# Altium schematic sheet IR_SCOOTER.SchDoc: IR_SCOOTER
size 420 x 297 mm; Engineer: ALPER KORKMAZ; SheetNumber: 1; SheetTotal: 8; SHEET: 1
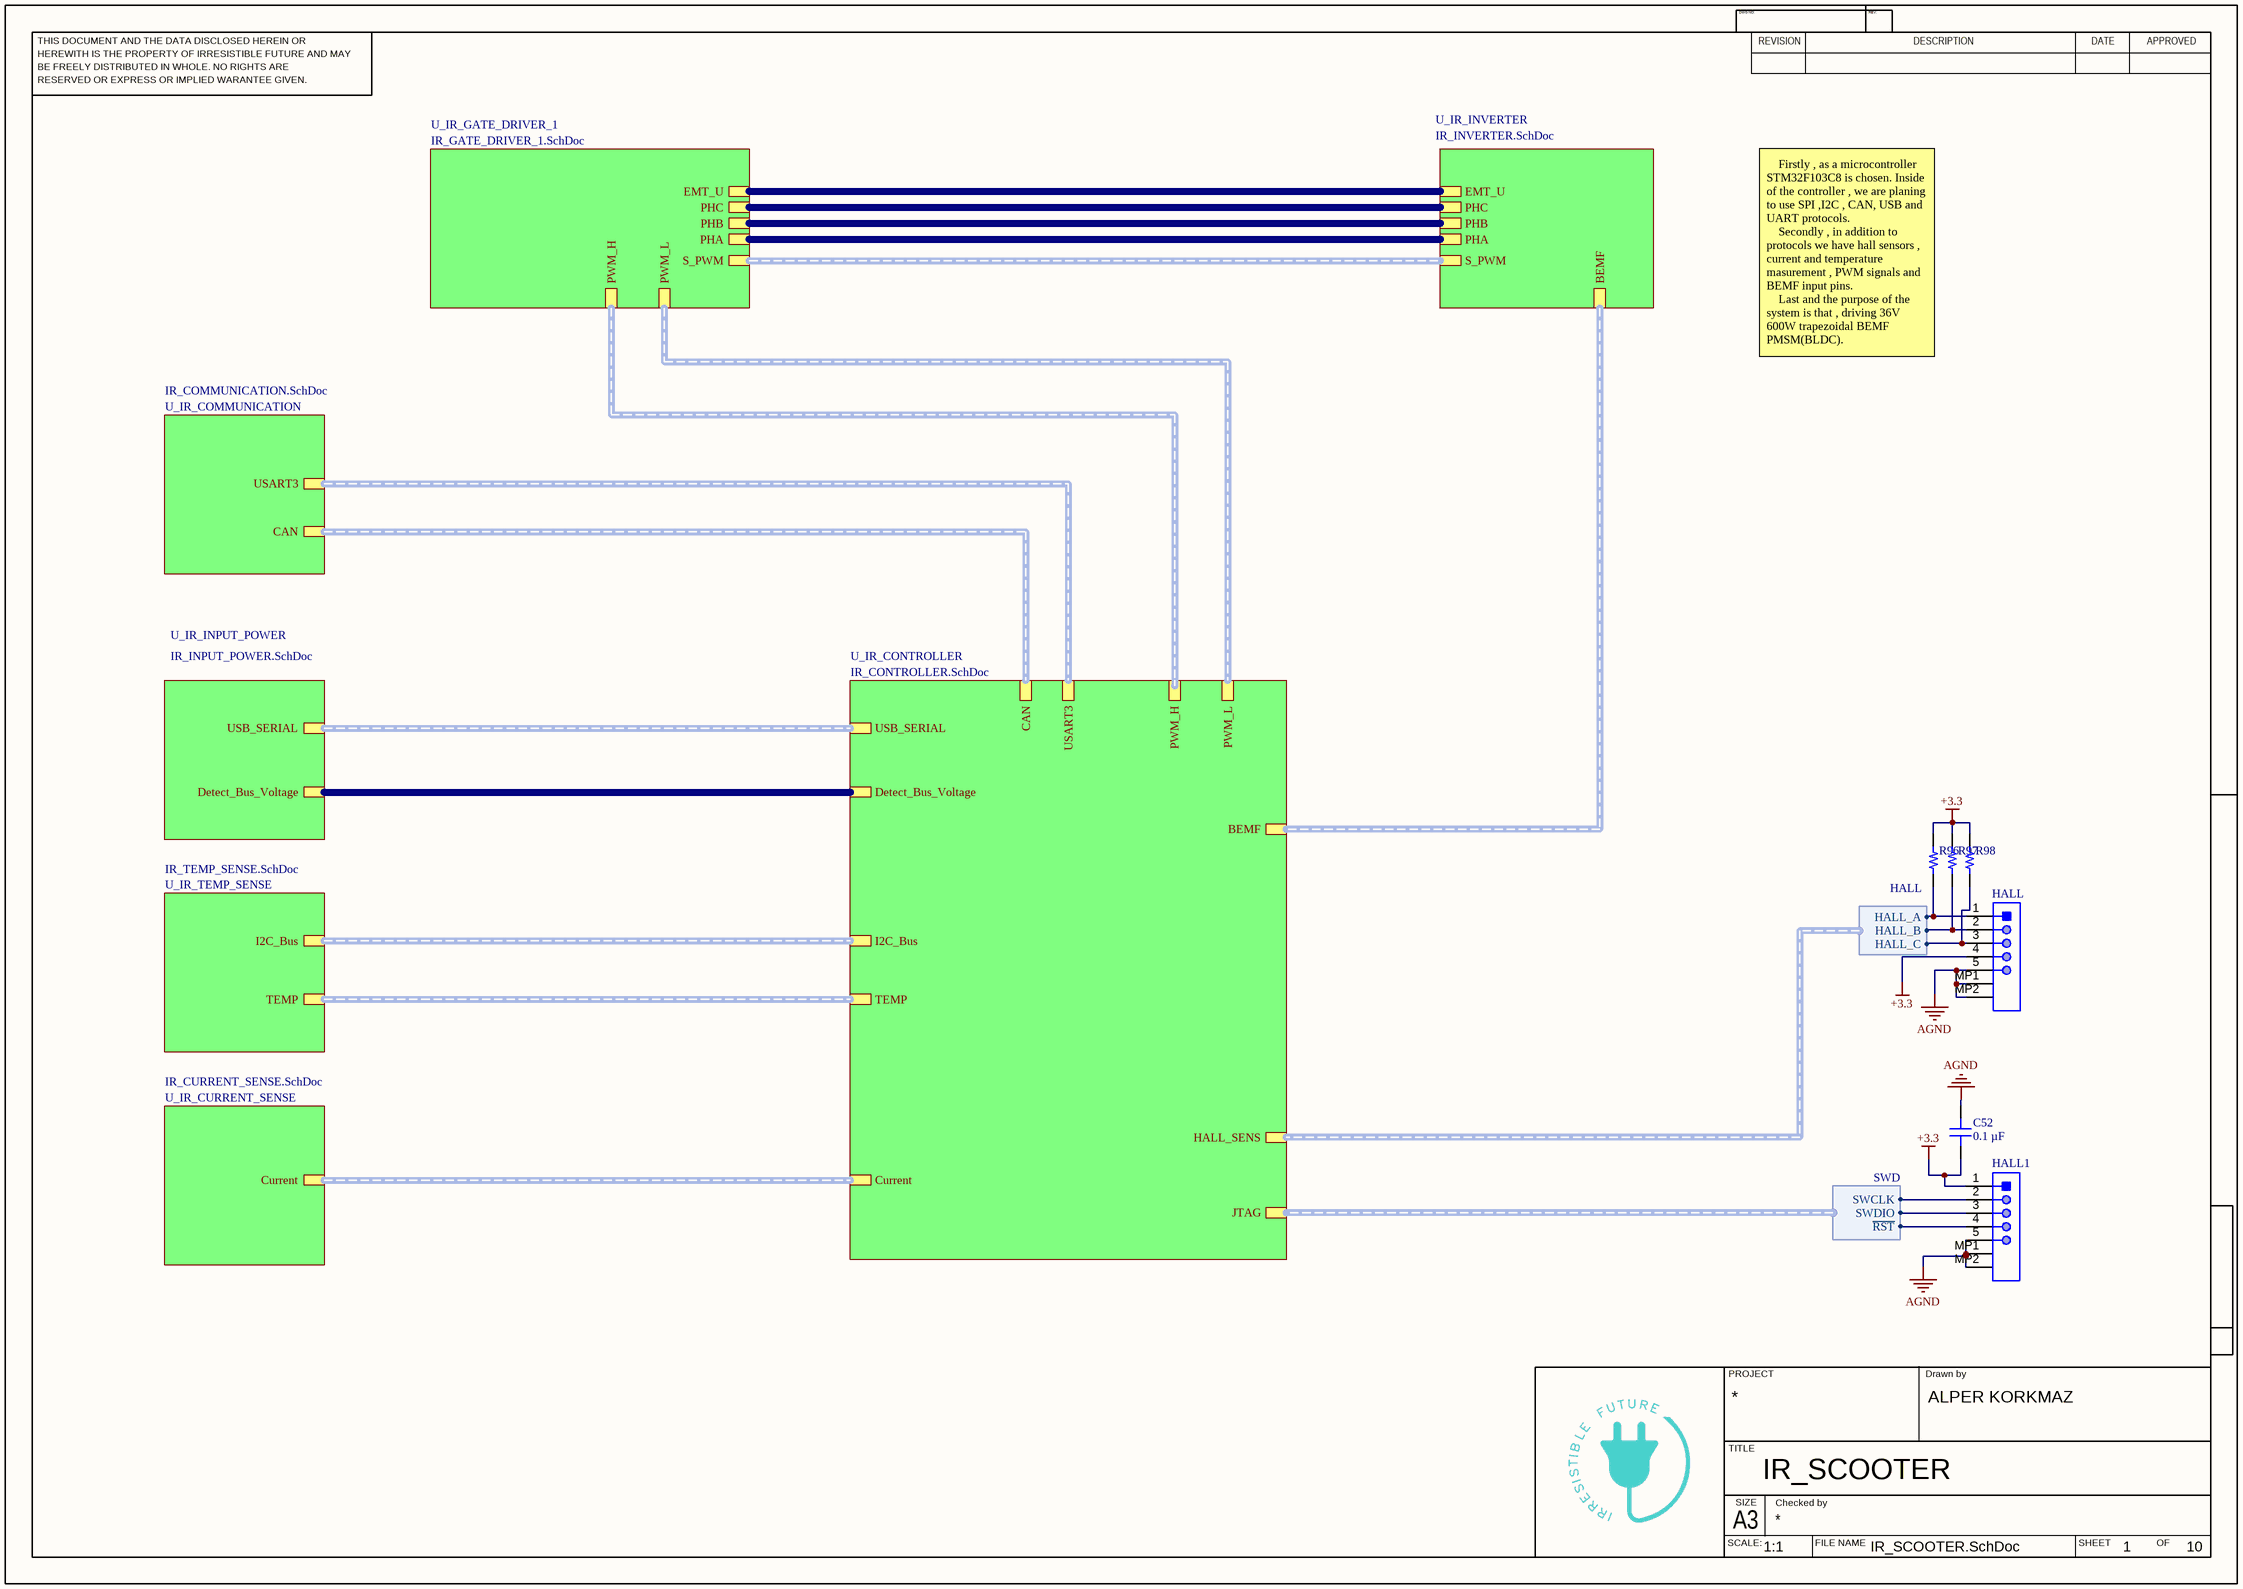
[diagram p0: IR_SCOOTER.SchDoc]

## Parts
C52  0.1 µF  [CAP 0805_2012]
HALL  53261-0571  [MOLX-52361-0571-5_V]  (value not drawn)
HALL1  53261-0571  [MOLX-52361-0571-5_V]  (value not drawn)
R96  10 kOhms  [RES 0603_1608]  (value not drawn)
R97  10 kOhms  [RES 0603_1608]  (value not drawn)
R98  10 kOhms  [RES 0603_1608]  (value not drawn)

## Sub-sheets
U_IR_COMMUNICATION = IR_COMMUNICATION.SchDoc: USART3 (harness SERIAL), CAN (harness CAN)
U_IR_CONTROLLER = IR_CONTROLLER.SchDoc: HALL_SENS (harness HALL), PWM_H (harness PWM_H), JTAG (harness SWD), BEMF (harness BEMF), USB_SERIAL (harness USB), PWM_L (harness PWM_L), I2C_Bus (harness I2C), Current (harness Current), CAN (harness CAN), USART3 (harness SERIAL), TEMP (harness TEMP), Detect_Bus_Voltage
U_IR_CURRENT_SENSE = IR_CURRENT_SENSE.SchDoc: Current (harness Current)
U_IR_GATE_DRIVER_1 = IR_GATE_DRIVER_1.SchDoc: S_PWM (harness S_PWM), PHA, PHB, PHC, EMT_U, PWM_H (harness PWM_H), PWM_L (harness PWM_L)
U_IR_INPUT_POWER = IR_INPUT_POWER.SchDoc: Detect_Bus_Voltage, USB_SERIAL (harness USB)
U_IR_INVERTER = IR_INVERTER.SchDoc: BEMF (harness BEMF), S_PWM (harness S_PWM), PHA, PHB, PHC, EMT_U
U_IR_TEMP_SENSE = IR_TEMP_SENSE.SchDoc: I2C_Bus (harness I2C), TEMP (harness TEMP)

## Harnesses
SWD: SWCLK, SWDIO, ~{RST}
HALL: HALL_C, HALL_B, HALL_A

## Nets
+3.3: C52.1 HALL.4 HALL1.1 R96.2 R97.2 R98.2
AGND: C52.2 HALL.5 HALL.MP1 HALL.MP2 HALL1.5 HALL1.MP1 HALL1.MP2
NetHALL1_2: HALL1.2 ; sheet U_IR_CONTROLLER/JTAG.SWCLK
NetHALL1_3: HALL1.3 ; sheet U_IR_CONTROLLER/JTAG.SWDIO
NetHALL1_4: HALL1.4 ; sheet U_IR_CONTROLLER/JTAG.~{RST}
NetHALL_1: HALL.1 R96.1 ; sheet U_IR_CONTROLLER/HALL_SENS.HALL_A
NetHALL_2: HALL.2 R97.1 ; sheet U_IR_CONTROLLER/HALL_SENS.HALL_B
NetHALL_3: HALL.3 R98.1 ; sheet U_IR_CONTROLLER/HALL_SENS.HALL_C
(unnamed): sheet U_IR_CONTROLLER/Detect_Bus_Voltage, sheet U_IR_INPUT_POWER/Detect_Bus_Voltage
(unnamed): sheet U_IR_GATE_DRIVER_1/PHA, sheet U_IR_INVERTER/PHA
(unnamed): sheet U_IR_GATE_DRIVER_1/PHB, sheet U_IR_INVERTER/PHB
(unnamed): sheet U_IR_GATE_DRIVER_1/PHC, sheet U_IR_INVERTER/PHC
(unnamed): sheet U_IR_GATE_DRIVER_1/EMT_U, sheet U_IR_INVERTER/EMT_U

## Buses and harness runs
harness sheet U_IR_COMMUNICATION/CAN = sheet U_IR_CONTROLLER/CAN
harness sheet U_IR_COMMUNICATION/USART3 = sheet U_IR_CONTROLLER/USART3
harness sheet U_IR_CONTROLLER/BEMF = sheet U_IR_INVERTER/BEMF
harness sheet U_IR_CONTROLLER/Current = sheet U_IR_CURRENT_SENSE/Current
harness sheet U_IR_CONTROLLER/I2C_Bus = sheet U_IR_TEMP_SENSE/I2C_Bus
harness sheet U_IR_CONTROLLER/PWM_H = sheet U_IR_GATE_DRIVER_1/PWM_H
harness sheet U_IR_CONTROLLER/PWM_L = sheet U_IR_GATE_DRIVER_1/PWM_L
harness sheet U_IR_CONTROLLER/TEMP = sheet U_IR_TEMP_SENSE/TEMP
harness sheet U_IR_CONTROLLER/USB_SERIAL = sheet U_IR_INPUT_POWER/USB_SERIAL
harness sheet U_IR_GATE_DRIVER_1/S_PWM = sheet U_IR_INVERTER/S_PWM

## Notes on the sheet
- Firstly , as a microcontroller STM32F103C8 is chosen. Inside of the controller , we are planing to use SPI ,I2C , CAN, USB and UART protocols.
  Secondly , in addition to protocols we have hall sensors , current and temperature masurement , PWM signals and BEMF input pins.
  Last and the purpose of the system is that , driving 36V 600W trapezoidal BEMF PMSM(BLDC).
- THIS DOCUMENT AND THE DATA DISCLOSED HEREIN OR
- HEREWITH IS THE PROPERTY OF IRRESISTIBLE FUTURE AND MAY
- DWG NO:
- REVISION
- REV:
- DESCRIPTION
- DATE
- APPROVED
- BE FREELY DISTRIBUTED IN WHOLE. NO RIGHTS ARE
- RESERVED OR EXPRESS OR IMPLIED WARANTEE GIVEN.
- PROJECT
- Drawn by
- TITLE
- SCALE:
- A3
- SIZE
- Checked by
- FILE NAME
- SHEET
- OF
- 1:1
- 10

## Library data of the parts
C52 = HMK212BJ104KG-T: CAP CER 0.1UF 100V X5R 0805; manufacturer: Taiyo Yuden; Tolerance: ±10%; Part Number: HMK212BJ104KG-T; Value: 0.1 µF; Applications: SMPS Filtering; Capacitance: 0.1 µF; componentlink1description: Datasheet; componentlink1url: https://www.yuden.co.jp/productdata/catalog/mlcc01_e.pdf; componentlink2description: DigiKey Link; componentlink2url: https://www.digikey.com/en/products/detail/taiyo-yuden/HMK212BJ104KG-T/4970697; Device Package: 0805 (2012 Metric); Features: High Voltage; lastupdated: 23.05.2022 12:58:06; Lifecycle Status: Active; Minimum Order: 1; Mounting Type: Surface Mount, MLCC; Operating Temperature: -55°C ~ 85°C; Package / Case: 0805 (2012 Metric); packaging: TapeAndReel; partid: 3711; Part Status: Active; price: 0.04; series: M; Size / Dimension: 0.079" L x 0.049" W (2.00mm x 1.25mm); Supplier 1: DigiKey; Supplier Part Number 1: 587-5863-1-ND; Temperature Coefficient: X5R; Thickness (Max): 0.053" (1.35mm); Voltage - Rated: 100V
HALL HALL1 = CMP-2000-05249-1: Male Header, Pitch 1.25 mm, 1 x 5 Position, Height 3.4 mm, RoHS, Tape and Reel; Brand: Molex; Mounting Angle: Right; Number of Positions: 5; Voltage Rating: 125V; Current Rating: 1A; Pitch: 1.25mm; Datasheet Version: Rev. D, 04/2004; Housing Material: Thermoplastic; Series: 53261; RoHS: Details; Product Category: Headers&WireHousings; Datasheet URL: http://datasheet.octopart.com/532610571-Molex-datasheet-8343080.pdf; Manufacturer URL: http://www.molex.com/; Contact Material: PhosphorBronze; Tradename: PicoBlade; Number of Rows: 1; Product Type: Headers; Manufacturer: Molex; Type: Shrouded; Termination Style: SMD; Mounting Style: SMD/SMT; Factory Pack Quantity: 1000; Contact Plating: Tin; Packaging: Reel; Number of Positions / Contacts: 5
R96-R98 = RNCS0603BKE10K0: RES 10K OHM 0.1% 1/16W 0603; Manufacturer: Stackpole Electronics Inc; Power (Watts): 0.063W, 1/16W; Temperature Coefficient: ±25ppm/°C; Part Number: RNCS0603BKE10K0; Value: 10 kOhms; ComponentLink1Description: Datasheet; ComponentLink1URL: https://www.seielect.com/catalog/sei-rncs_rnch.pdf; ComponentLink2Description: DigiKey Link; ComponentLink2URL: https://www.digikey.com/en/products/detail/stackpole-electronics-inc/RNCS0603BKE10K0/1708836; Composition: Thin Film; Device Package: 0603 (1608 Metric); Features: Anti-Corrosive, Automotive AEC-Q200, Moisture Resistant; Height - Seated (Max): 0.022" (0.55mm); LastUpdated: 30.06.2022 22:25:20; Lifecycle Status: Active; Minimum Order: 1; Number of Terminations: 2; Operating Temperature: -55°C ~ 155°C; Package / Case: 0603 (1608 Metric); Packaging: TapeAndReel; PartId: 4838; Part Status: Active; Price: 0.08; Ratings: AEC-Q200; Resistance: 10 kOhms; Series: RNCS; Size / Dimension: 0.061" L x 0.031" W (1.55mm x 0.80mm); Supplier 1: DigiKey; Supplier Part Number 1: RNCS0603BKE10K0CT-ND; Supplier Device Package: 0603; Tolerance: ±0.1%